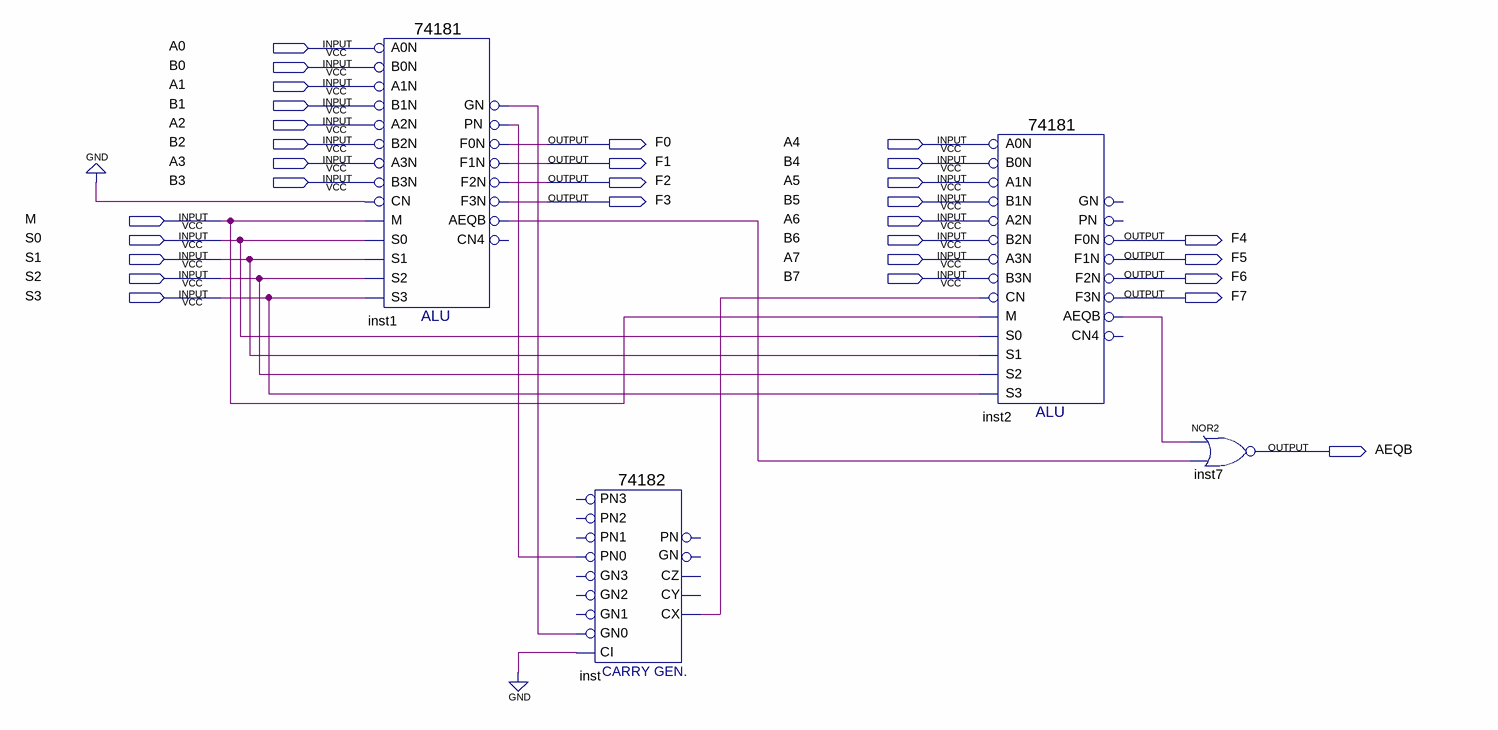
[diagram p0: schematic sheet]
// Quartus schematic 74181_8_bit_CU.bdf as structural Verilog: 4 symbols, 30 pins
module \74181_8_bit_CU  (
  input  A0,
  input  B0,
  input  A1,
  input  B1,
  input  A2,
  input  B2,
  input  A4,
  input  A3,
  input  B4,
  input  B3,
  input  A5,
  input  B5,
  input  M,
  input  A6,
  input  S0,
  input  B6,
  input  S1,
  input  A7,
  input  S2,
  input  B7,
  input  S3,
  output F0,
  output F1,
  output F2,
  output F3,
  output F4,
  output F5,
  output F6,
  output F7,
  output AEQB
);

  wire inst1_aeqb, inst1_gn, inst1_pn, inst2_aeqb, inst_cx;

  \74181  inst1 (
    .B0N(B0), .A0N(A0), .A1N(A1), .B1N(B1), .A3N(A3), .B2N(B2), .A2N(A2), .M(M), .CN(1'b0), .B3N(B3),
    .S2(S2), .S1(S1), .S0(S0), .S3(S3), .PN(inst1_pn), .GN(inst1_gn), .F3N(F3), .F1N(F1), .F0N(F0),
    .AEQB(inst1_aeqb), .F2N(F2));  // open: CN4
  \74182  inst (
    .CI(1'b0), .PN0(inst1_pn), .GN0(inst1_gn), .CX(inst_cx));  // open: PN2, GN2, GN3, PN3, PN1, GN1, CY, PN, CZ, GN
  \74181  inst2 (
    .B0N(B4), .A0N(A4), .A1N(A5), .B1N(B5), .A3N(A7), .B2N(B6), .A2N(A6), .M(M), .CN(inst_cx), .B3N(B7),
    .S2(S2), .S1(S1), .S0(S0), .S3(S3), .F3N(F7), .F1N(F5), .F0N(F4), .AEQB(inst2_aeqb), .F2N(F6));  // open: PN, GN, CN4
  nor inst7 (AEQB, inst2_aeqb, inst1_aeqb);
endmodule
